# EAGLE design pic_web_dil (EAGLE 5.06)
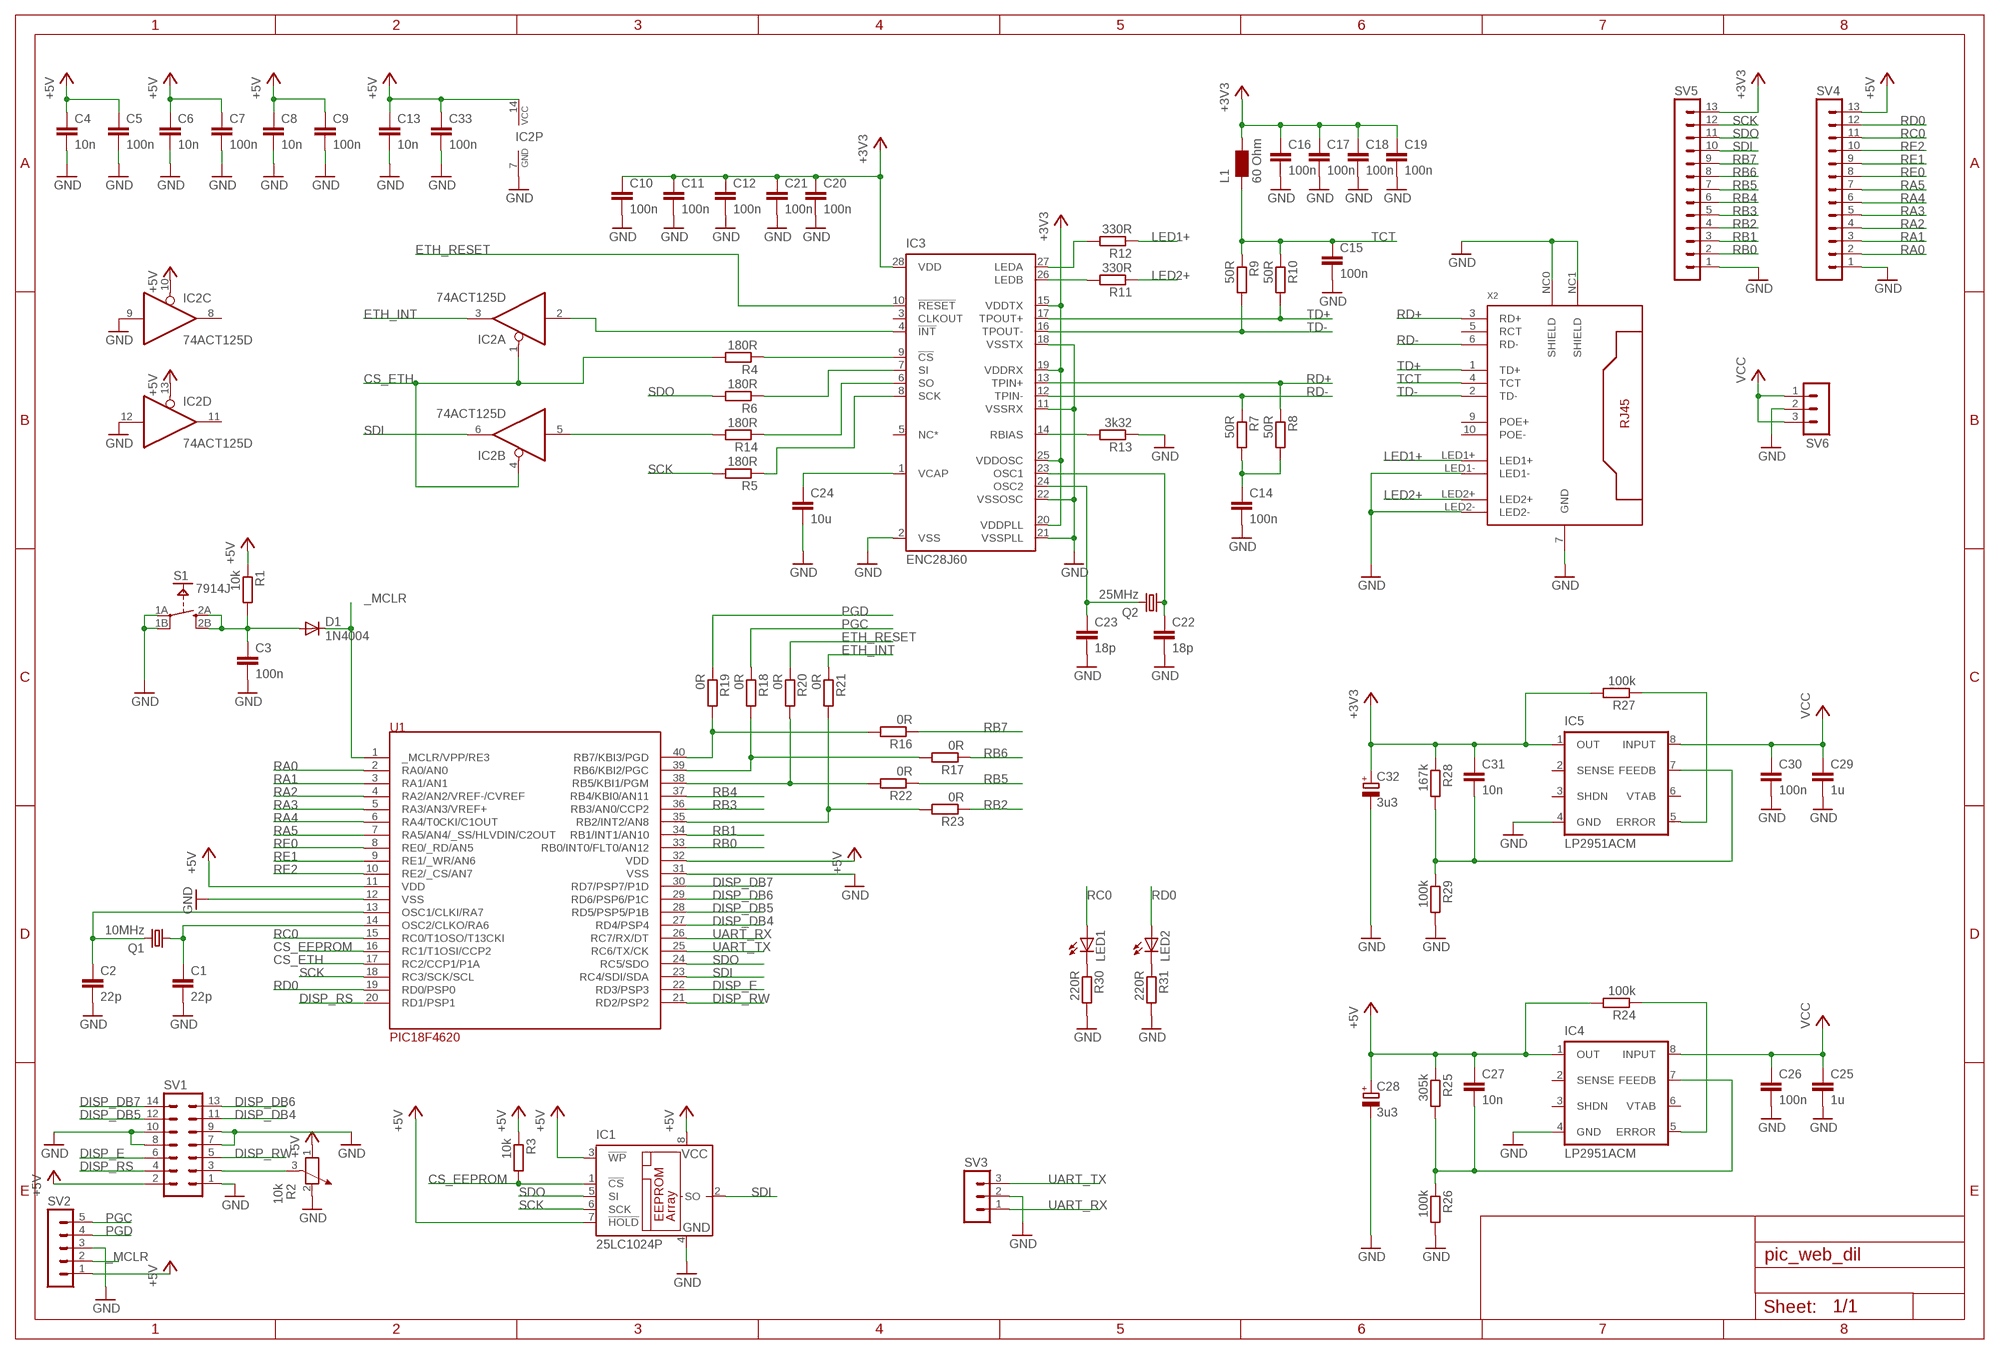
[diagram p0: schematic, sheet 1]

## Parts
C1  22p  C-EUC0603  [C0603]
C2  22p  C-EUC0603  [C0603]
C3  100n  C-EUC0603  [C0603]
C4  10n  C-EUC0603  [C0603]
C5  100n  C-EUC0603  [C0603]
C6  10n  C-EUC0603  [C0603]
C7  100n  C-EUC0603  [C0603]
C8  10n  C-EUC0603  [C0603]
C9  100n  C-EUC0603  [C0603]
C10  100n  C-EUC0603  [C0603]
C11  100n  C-EUC0603  [C0603]
C12  100n  C-EUC0603  [C0603]
C13  10n  C-EUC0603  [C0603]
C14  100n  C-EUC0603  [C0603]
C15  100n  C-EUC0603  [C0603]
C16  100n  C-EUC0603  [C0603]
C17  100n  C-EUC0603  [C0603]
C18  100n  C-EUC0603  [C0603]
C19  100n  C-EUC0603  [C0603]
C20  100n  C-EUC0603  [C0603]
C21  100n  C-EUC0603  [C0603]
C22  18p  C-EUC0603  [C0603]
C23  18p  C-EUC0603  [C0603]
C24  10u  C-EUC1210  [C1210]
C25  1u  C-EUC0603  [C0603]
C26  100n  C-EUC0603  [C0603]
C27  10n  C-EUC0603  [C0603]
C28  3u3  CPOL-EUB/3528-21W  [B/3528-21W]
C29  1u  C-EUC0603  [C0603]
C30  100n  C-EUC0603  [C0603]
C31  10n  C-EUC0603  [C0603]
C32  3u3  CPOL-EUB/3528-21W  [B/3528-21W]
C33  100n  C-EUC0603  [C0603]
D1  1N4004  DIODE-MELF-MLL41  [MELF-MLL41]
IC1  25LC1024P  [DIL8]
IC2  74ACT125D  [SO14]
IC3  ENC28J60  ENC28J60SP  [DIL28-3]
IC4  LP2951ACM  [SO-08]
IC5  LP2951ACM  [SO-08]
L1  60 Ohm  WE-KIHQ_0805  [WE-KI_0805_B]
LED1  LEDCHIP-LED0603  [CHIP-LED0603]
LED2  LEDCHIP-LED0603  [CHIP-LED0603]
Q1  10MHz  CRYSTALHC49UP  [HC49UP]
Q2  25MHz  CRYSTALHC49UP  [HC49UP]
R1  10k  R-EU_R0603  [R0603]
R2  10k  POTENTIOMETER_PT-10  [PT-10]
R3  10k  R-EU_R0603  [R0603]
R4  180R  R-EU_R0603  [R0603]
R5  180R  R-EU_R0603  [R0603]
R6  180R  R-EU_R0603  [R0603]
R7  50R  R-EU_R0603  [R0603]
R8  50R  R-EU_R0603  [R0603]
R9  50R  R-EU_R0603  [R0603]
R10  50R  R-EU_R0603  [R0603]
R11  330R  R-EU_R0603  [R0603]
R12  330R  R-EU_R0603  [R0603]
R13  3k32  R-EU_R0603  [R0603]
R14  180R  R-EU_R0603  [R0603]
R16  0R  R-EU_R0603  [R0603]
R17  0R  R-EU_R0603  [R0603]
R18  0R  R-EU_R0603  [R0603]
R19  0R  R-EU_R0603  [R0603]
R20  0R  R-EU_R0603  [R0603]
R21  0R  R-EU_R0603  [R0603]
R22  0R  R-EU_R0603  [R0603]
R23  0R  R-EU_R0603  [R0603]
R24  100k  R-EU_R0603  [R0603]
R25  305k  R-EU_R0603  [R0603]
R26  100k  R-EU_R0603  [R0603]
R27  100k  R-EU_R0603  [R0603]
R28  167k  R-EU_R0603  [R0603]
R29  100k  R-EU_R0603  [R0603]
R30  220R  R-EU_R0603  [R0603]
R31  220R  R-EU_R0603  [R0603]
S1  7914J  [7914SMD]
SV1  MA07-2  [MA07-2]
SV2  MA05-1  [MA05-1]
SV3  MA03-1  [MA03-1]
SV4  MA13-1  [MA13-1]
SV5  MA13-1  [MA13-1]
SV6  MA03-1  [MA03-1]
U1  PIC18F4620  PIC18F4620-I/P  [DIL40]
X2  RJ45-8-POETAIMAG  [WE_POE]

## Nets
+3V3: C10.1 C11.1 C12.1 C16.1 C17.1 C18.1 C19.1 C20.1 C21.1 C31.1 C32.+ IC3.15(VDDTX) IC3.19(VDDRX) IC3.20(VDDPLL) IC3.25(VDDOSC) IC3.28(VDD) IC5.1(OUT) L1.1 R27.2 R28.1 SV5.13
+5V: C4.1 C5.1 C6.1 C7.1 C8.1 C9.1 C13.1 C27.1 C28.+ C33.1 IC1.3(!WP) IC1.7(!HOLD) IC1.8(VCC) IC2.10(C:OE) IC2.13(D:OE) IC2.14(P:VCC) IC4.1(OUT) R1.1 R2.1 R3.1 R24.2 R25.1 SV1.2 SV2.1 SV4.13 U1.11(VDD) U1.32(VDD)
_MCLR: D1.C SV2.2 U1.1(_MCLR/VPP/RE3)
CS_EEPROM: IC1.1(!CS) R3.2 U1.16(RC1/T1OSI/CCP2)
CS_ETH: IC2.1(A:OE) IC2.4(B:OE) R4.2 U1.17(RC2/CCP1/P1A)
DISP_DB4: SV1.11 U1.27(RD4/PSP4)
DISP_DB5: SV1.12 U1.28(RD5/PSP5/P1B)
DISP_DB6: SV1.13 U1.29(RD6/PSP6/P1C)
DISP_DB7: SV1.14 U1.30(RD7/PSP7/P1D)
DISP_E: SV1.6 U1.22(RD3/PSP3)
DISP_RS: SV1.4 U1.20(RD1/PSP1)
DISP_RW: SV1.5 U1.21(RD2/PSP2)
ETH_INT: IC2.3(A:O) R21.1
ETH_RESET: IC3.10(!RESET) R20.1
GND: C1.2 C2.2 C3.2 C4.2 C5.2 C6.2 C7.2 C8.2 C9.2 C10.2 C11.2 C12.2 C13.2 C14.2 C15.2 C16.2 C17.2 C18.2 C19.2 C20.2 C21.2 C22.2 C23.2 C24.2 C25.2 C26.2 C28.- C29.2 C30.2 C32.- C33.2 IC1.4(GND) IC2.7(P:GND) IC2.9(C:I) IC2.12(D:I) IC3.2(VSS) IC3.11(VSSRX) IC3.18(VSSTX) IC3.21(VSSPLL) IC3.22(VSSOSC) IC4.4(GND) IC5.4(GND) R2.2 R13.1 R26.2 R29.2 R30.2 R31.2 S1.1A(P) S1.1B(P) SV1.1 SV1.7 SV1.8 SV1.9 SV1.10 SV2.3 SV3.2 SV4.1 SV5.1 SV6.2 U1.12(VSS) U1.31(VSS) X2.7(GND) X2.LED1- X2.LED2- X2.NC0(SHIELD) X2.NC1(SHIELD)
LED1+: R12.1 X2.LED1+
LED2+: R11.1 X2.LED2+
N$1: C2.1 Q1.2 U1.13(OSC1/CLKI/RA7)
N$2: C1.1 Q1.1 U1.14(OSC2/CLKO/RA6)
N$3: C3.1 D1.A R1.2 S1.2A(S) S1.2B(S)
N$4: R2.3 SV1.3
N$5: LED1.C R30.1
N$6: IC3.6(SO) R14.1
N$7: IC3.7(SI) R6.1
N$8: IC3.26(LEDB) R11.2
N$9: IC3.8(SCK) R5.1
N$10: IC3.9(!CS) R4.1
N$11: IC3.27(LEDA) R12.2
N$13: C14.1 R7.2 R8.2
N$14: C23.1 IC3.24(OSC2) Q2.2
N$15: C22.1 IC3.23(OSC1) Q2.1
N$16: IC3.14(RBIAS) R13.2
N$17: C24.1 IC3.1(VCAP)
N$18: R20.2 R22.2 U1.38(RB5/KBI1/PGM)
N$19: LED2.C R31.1
N$20: R17.2 R18.2 U1.39(RB6/KBI2/PGC)
N$21: R16.2 R19.2 U1.40(RB7/KBI3/PGD)
N$22: R21.2 R23.2 U1.35(RB2/INT2/AN8)
N$23: IC4.5(ERROR) R24.1
N$24: IC5.5(ERROR) R27.1
N$25: C31.2 IC5.7(FEEDB) R28.2 R29.1
N$26: C27.2 IC4.7(FEEDB) R25.2 R26.1
N$29: IC2.2(A:I) IC3.4(!INT)
N$30: IC2.5(B:I) R14.2
PGC: R18.1 SV2.5
PGD: R19.1 SV2.4
RA0: SV4.2 U1.2(RA0/AN0)
RA1: SV4.3 U1.3(RA1/AN1)
RA2: SV4.4 U1.4(RA2/AN2/VREF-/CVREF)
RA3: SV4.5 U1.5(RA3/AN3/VREF+)
RA4: SV4.6 U1.6(RA4/T0CKI/C1OUT)
RA5: SV4.7 U1.7(RA5/AN4/_SS/HLVDIN/C2OUT)
RB0: SV5.2 U1.33(RB0/INT0/FLT0/AN12)
RB1: SV5.3 U1.34(RB1/INT1/AN10)
RB2: R23.1 SV5.4
RB3: SV5.5 U1.36(RB3/AN0/CCP2)
RB4: SV5.6 U1.37(RB4/KBI0/AN11)
RB5: R22.1 SV5.7
RB6: R17.1 SV5.8
RB7: R16.1 SV5.9
RC0: LED1.A SV4.11 U1.15(RC0/T1OSO/T13CKI)
RD0: LED2.A SV4.12 U1.19(RD0/PSP0)
RD+: IC3.13(TPIN+) R8.1 X2.3(RD+)
RD-: IC3.12(TPIN-) R7.1 X2.6(RD-)
RE0: SV4.8 U1.8(RE0/_RD/AN5)
RE1: SV4.9 U1.9(RE1/_WR/AN6)
RE2: SV4.10 U1.10(RE2/_CS/AN7)
SCK: IC1.6(SCK) R5.2 SV5.12 U1.18(RC3/SCK/SCL)
SDI: IC1.2(SO) IC2.6(B:O) SV5.10 U1.23(RC4/SDI/SDA)
SDO: IC1.5(SI) R6.2 SV5.11 U1.24(RC5/SDO)
TCT: C15.1 L1.2 R9.1 R10.1 X2.4(TCT)
TD+: IC3.17(TPOUT+) R10.2 X2.1(TD+)
TD-: IC3.16(TPOUT-) R9.2 X2.2(TD-)
UART_RX: SV3.1 U1.26(RC7/RX/DT)
UART_TX: SV3.3 U1.25(RC6/TX/CK)
VCC: C25.1 C26.1 C29.1 C30.1 IC4.8(INPUT) IC5.8(INPUT) SV6.1 SV6.3
Unconnected: IC2.8(C:O) IC2.11(D:O) IC3.3(CLKOUT) IC3.5(NC*) IC4.2(SENSE) IC4.3(SHDN) IC4.6(VTAB) IC5.2(SENSE) IC5.3(SHDN) IC5.6(VTAB) X2.5(RCT)

## Power pins joined to a net without a drawn wire
POE+: X2.9(POE+)
POE-: X2.10(POE-)

## Library data of the parts
C1-C23 C25-C27 C29-C31 C33 = rcl:C-EU: CAPACITOR, European symbol
C24 = resistor:C-EU: CAPACITOR, European symbol
C28 C32 = rcl:CPOL-EU: POLARIZED CAPACITOR, European symbol
D1 = diode:DIODE-: DIODE
IC1 = sld:25*: Serial EEPROM 4 K, SPI bus
IC2 = 74xx-eu:74*125: Quad bus BUFFER, 3-state
IC3 = sld:ENC28J60: Stand-Alone Ethernet Controller with SPI Interface Source: http://ww1.microchip.com/downloads/en/DeviceDoc/39662c.pdf
IC4 IC5 = v-reg:LP2951?*: Series of Adjustable Micropower Voltage Regulators Source: http://cache.national.com/ds/LP/LP2950.pdf
L1 = wuerth-elektronik:WE-KIHQ: SMD Wire Wound Ceramic Inductor WE-KIHQ - High current - Highest Quality factor in size 0805 - up to 98 - High thermal stability - High SRF -- Bluetooth -- Wireless LAN -- RF oscillation circuit -- IF impedance matching -- IG choke
LED1 LED2 = led:LED: LED OSRAM: - CHIPLED LG R971, LG N971, LY N971, LG Q971, LY Q971, LO R971, LY R971 LH N974, LH R974 LS Q976, LO Q976, LY Q976 LO Q996 - Hyper CHIPLED LW Q18S LB Q993, LB Q99A, LB R99A - SideLED LS A670, LO A670, LY A670, LG A670, LP A670 LB A673, LV A673, LT A673, LW A673 LH A674 LY A675 LS A676, LA A676, LO A676, LY A676, LW A676 LS A679, LY A679, LG A679 - Hyper Micro SIDELED® LS Y876, LA Y876, LO Y876, LY Y876 LT Y87S - SmartLED LW L88C, LW L88S LB L89C, LB L89S, LG L890 LS L89K, LO L89K, LY L89K LS L896, LA L896, LO L896, LY L896 - TOPLED LS T670, LO T670, LY T670, LG T670, LP T670 LSG T670, LSP T670, LSY T670, LOP T670, LYG T670 LG T671, LOG T671, LSG T671 LB T673, LV T673, LT T673, LW T673 LH T674 LS T676, LA T676, LO T676, LY T676, LB T676, LH T676, LSB T676, LW T676 LB T67C, LV T67C, LT T67C, LS T67K, LO T67K, LY T67K, LW E67C LS E67B, LA E67B, LO E67B, LY E67B, LB E67C, LV E67C, LT E67C LW T67C LS T679, LY T679, LG T679 LS T770, LO T770, LY T770, LG T770, LP T770 LB T773, LV T773, LT T773, LW T773 LH T774 LS E675, LA E675, LY E675, LS T675 LS T776, LA T776, LO T776, LY T776, LB T776 LHGB T686 LT T68C, LB T68C - Hyper Mini TOPLED® LB M676 - Mini TOPLED Santana® LG M470 LS M47K, LO M47K, LY M47K Source: http://www.osram.convergy.de LUXEON: - LUMILED® LXK2-PW12-R00, LXK2-PW12-S00, LXK2-PW14-U00, LXK2-PW14-V00 LXK2-PM12-R00, LXK2-PM12-S00, LXK2-PM14-U00 LXK2-PE12-Q00, LXK2-PE12-R00, LXK2-PE12-S00, LXK2-PE14-T00, LXK2-PE14-U00 LXK2-PB12-K00, LXK2-PB12-L00, LXK2-PB12-M00, LXK2-PB14-N00, LXK2-PB14-P00, LXK2-PB14-Q00 LXK2-PR12-L00, LXK2-PR12-M00, LXK2-PR14-Q00, LXK2-PR14-R00 LXK2-PD12-Q00, LXK2-PD12-R00, LXK2-PD12-S00 LXK2-PH12-R00, LXK2-PH12-S00 LXK2-PL12-P00, LXK2-PL12-Q00, LXK2-PL12-R00 Source: www.luxeon.com KINGBRIGHT: KA-3528ASYC Source: www.kingbright.com
Q1 Q2 = sld:CRYSTAL: CRYSTAL
R1 R3-R14 R16-R31 = rcl:R-EU_: RESISTOR, European symbol
R2 = rcl:POTENTIOMETER_: Potentiometer
S1 = sld:7914J
SV1 = con-lstb:MA07-2: PIN HEADER
SV2 = con-lstb:MA05-1: PIN HEADER
SV3 SV6 = con-lstb:MA03-1: PIN HEADER
SV4 SV5 = con-lstb:MA13-1: PIN HEADER
U1 = sld:PIC18F4620
X2 = welectronic:RJ45-8-POE: Würth Elektronik RJ45: WE-7499211121 Taimag RJ45: RJPLB-203TC1 Tyco RJ45: 6605822

## Board
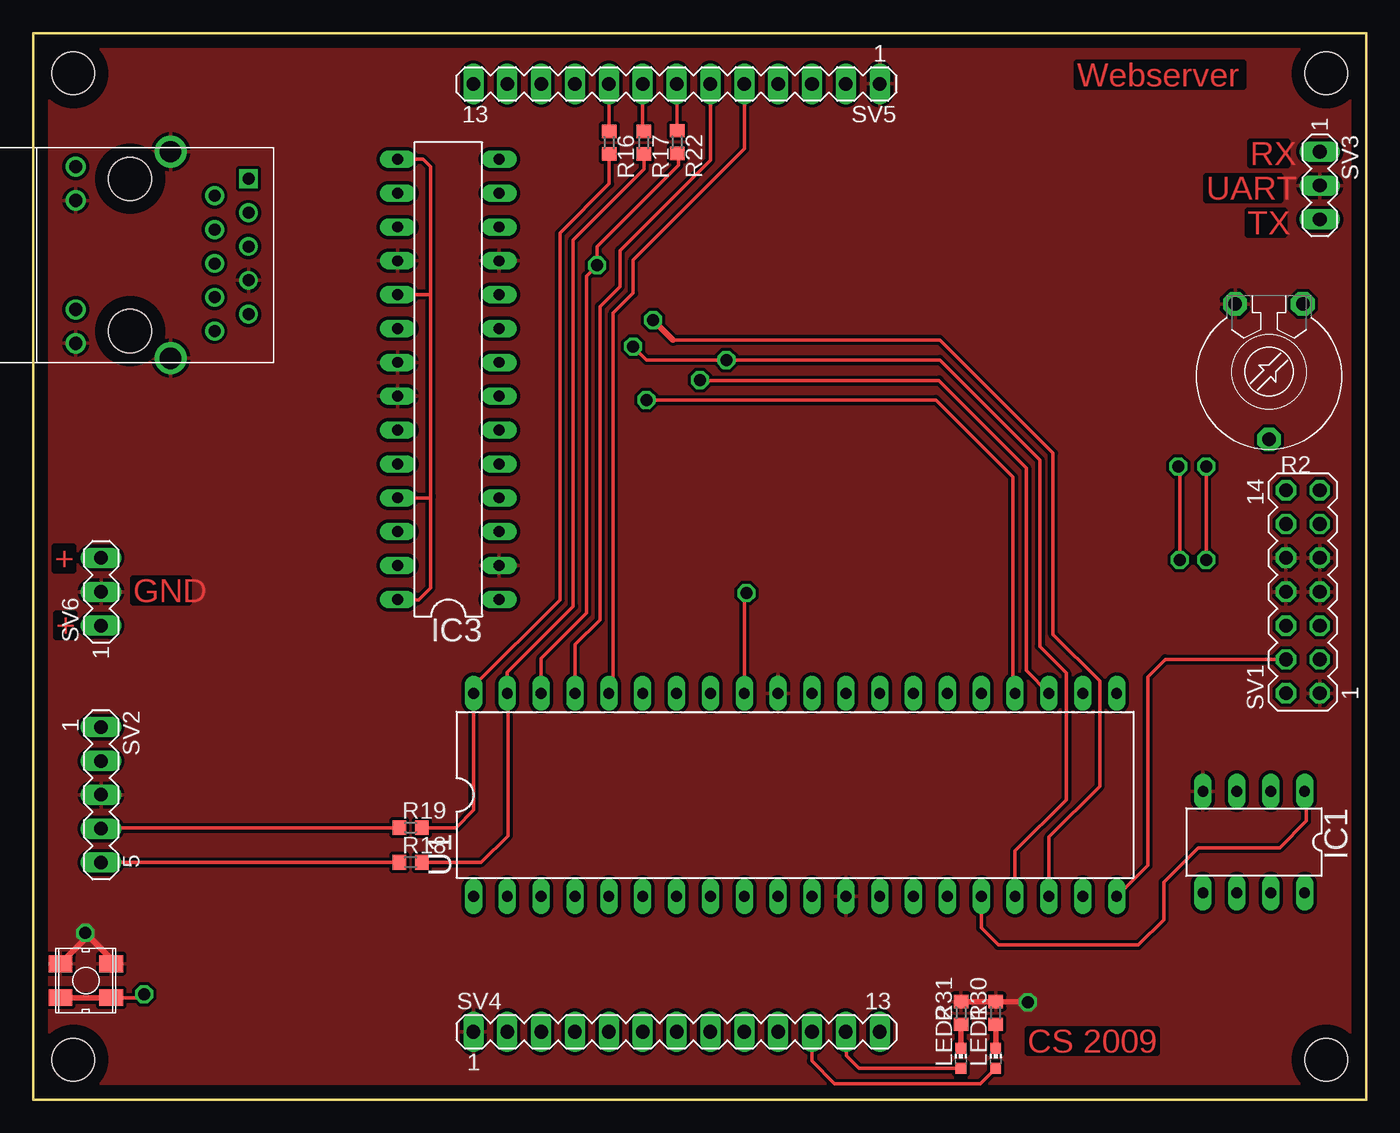
[diagram p1: board, top side]
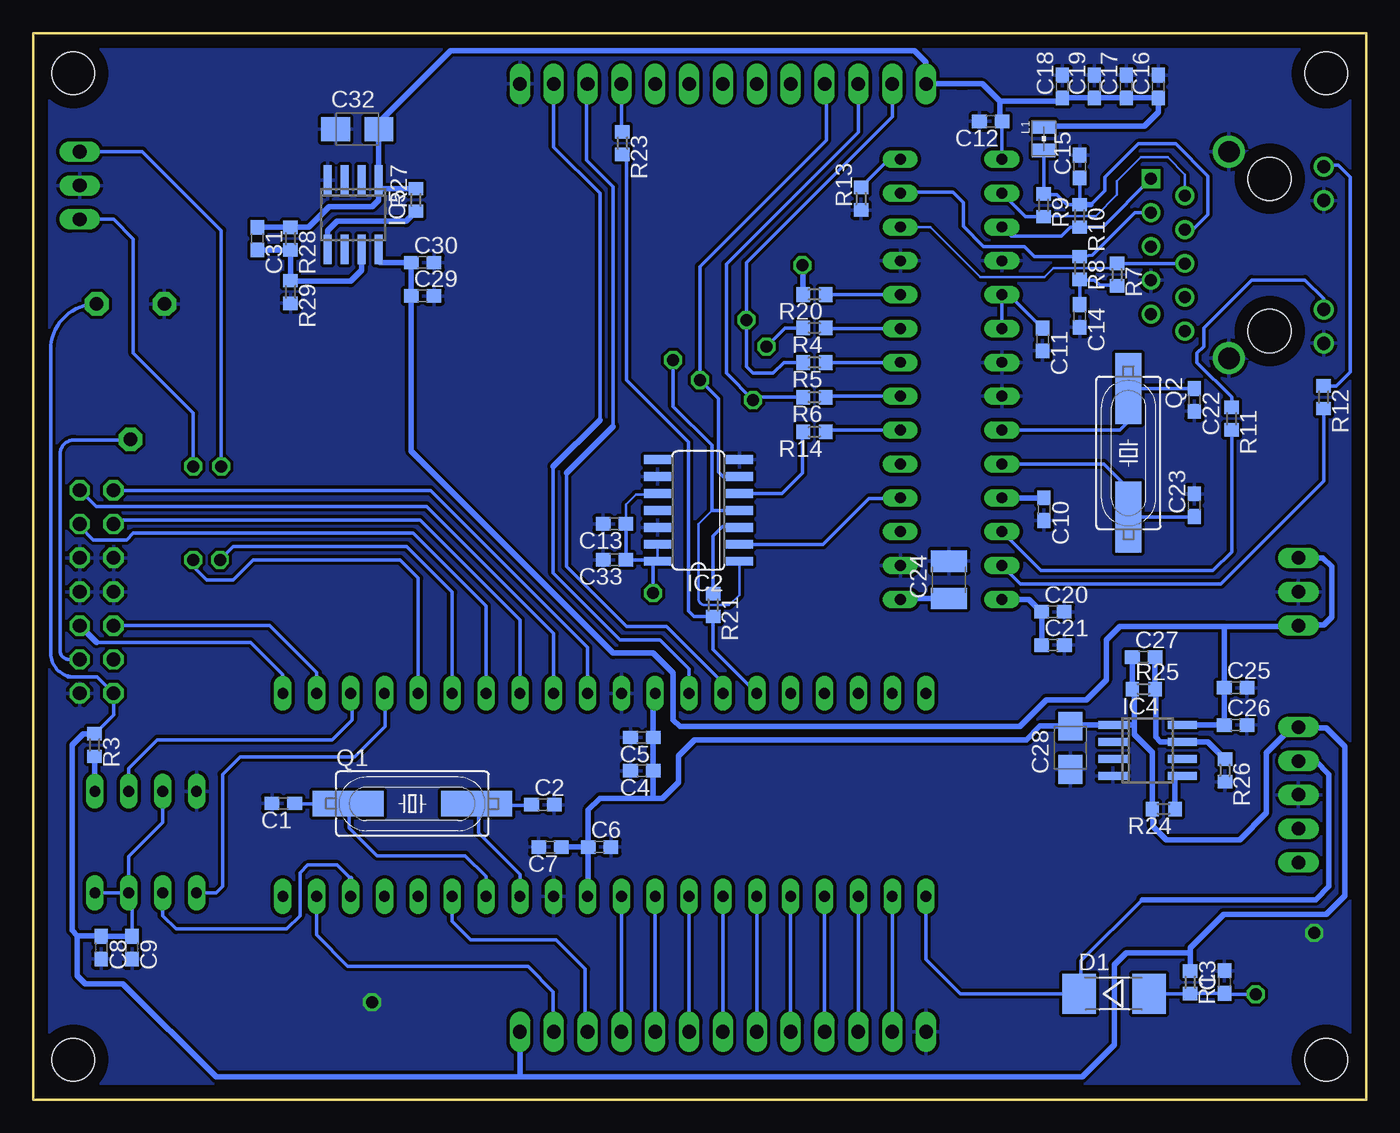
[diagram p2: board, bottom side, seen from below]

Size 100 x 80 mm. Coordinates in mm from the lower left corner, seen from the top.
Outline: 0,0 100,0 100,80 0,80 0,0
Copper layers (1*16): Top 0.035mm / dielectric 1.5mm / Bottom 0.035mm
Design rules "default *": minimum track width 0.2mm, minimum drill 0.4mm, track to track 0.25mm, track to pad 0.25mm, pad to pad 0.25mm, via to via 0.25mm, smd to smd 0.25mm, copper to edge 1mm, drill to drill 0.25mm, minimum pad ring 10mil, minimum via ring 8mil, stop-mask expansion 4mil, vias tented up to drill 0mil, thermal gap 10mil
Holes 3.2 mm at 3,77 97,77 97,3 3,3

### Footprints (pad centres in the part's own frame; a part is rotated, then mirrored left to right if it is on the bottom)
C0603 = smd 1.1 x 1: 1 -0.85,0; 2 0.85,0
C1210 = smd 1.6 x 2.7: 1 -1.4,0; 2 1.4,0
B/3528-21W = smd 2.15 x 1.8: + 1.625,0; - -1.625,0
MELF-MLL41 = smd 2.5 x 3: A 2.625,0; C -2.625,0
DIL8 = drill 0.813 long: 1 -3.81,-3.81; 2 -1.27,-3.81; 3 1.27,-3.81; 4 3.81,-3.81; 5 3.81,3.81; 6 1.27,3.81; 7 -1.27,3.81; 8 -3.81,3.81
SO14 = smd 0.66 x 2.032: 1 -3.81,-3.073; 2 -2.54,-3.073; 3 -1.27,-3.073; 4 0,-3.073; 5 1.27,-3.073; 6 2.54,-3.073; 7 3.81,-3.073; 8 3.81,3.073; 9 2.54,3.073; 10 1.27,3.073; 11 0,3.073; 12 -1.27,3.073; 13 -2.54,3.073; 14 -3.81,3.073
DIL28-3 = drill 0.813 long: 1 -16.51,-3.81; 2 -13.97,-3.81; 3 -11.43,-3.81; 4 -8.89,-3.81; 5 -6.35,-3.81; 6 -3.81,-3.81; 7 -1.27,-3.81; 8 1.27,-3.81; 9 3.81,-3.81; 10 6.35,-3.81; 11 8.89,-3.81; 12 11.43,-3.81; 13 13.97,-3.81; 14 16.51,-3.81; 15 16.51,3.81; 16 13.97,3.81; 17 11.43,3.81; 18 8.89,3.81; 19 6.35,3.81; 20 3.81,3.81; 21 1.27,3.81; 22 -1.27,3.81; 23 -3.81,3.81; 24 -6.35,3.81; 25 -8.89,3.81; 26 -11.43,3.81; 27 -13.97,3.81; 28 -16.51,3.81
SO-08 = smd 0.6 x 2.2: 1 -1.905,-2.6; 2 -0.635,-2.6; 3 0.635,-2.6; 4 1.905,-2.6; 5 1.905,2.6; 6 0.635,2.6; 7 -0.635,2.6; 8 -1.905,2.6
WE-KI_0805_B = smd 1.02 x 1.78: 1 -0.89,0; 2 0.89,0
CHIP-LED0603 = smd 0.8 x 0.8: A 0,-0.75; C 0,0.75
HC49UP = smd 5.334 x 1.93: 1 -4.826,0; 2 4.826,0
R0603 = smd 1 x 1.1: 1 -0.85,0; 2 0.85,0
PT-10 = drill 1.016 pad 1.778 octagon: 1 -2.54,-5.08; 2 2.54,-5.08; 3 0,5.08
7914SMD = smd 1.27 x 1.778: 1A 0,0; 1B 0,3.81; 2A 2.54,0; 2B 2.54,3.81
MA07-2 = drill 1.016 octagon: 1 -7.62,-1.27; 2 -7.62,1.27; 3 -5.08,-1.27; 4 -5.08,1.27; 5 -2.54,-1.27; 6 -2.54,1.27; 7 0,-1.27; 8 0,1.27; 9 2.54,-1.27; 10 2.54,1.27; 11 5.08,-1.27; 12 5.08,1.27; 13 7.62,-1.27; 14 7.62,1.27
MA05-1 = drill 1.016 long: 1 -5.08,0; 2 -2.54,0; 3 0,0; 4 2.54,0; 5 5.08,0
MA03-1 = drill 1.016 long: 1 -2.54,0; 2 0,0; 3 2.54,0
MA13-1 = drill 1.016 long: 1 -15.24,0; 2 -12.7,0; 3 -10.16,0; 4 -7.62,0; 5 -5.08,0; 6 -2.54,0; 7 0,0; 8 2.54,0; 9 5.08,0; 10 7.62,0; 11 10.16,0; 12 12.7,0; 13 15.24,0
DIL40 = drill 0.813 long: 1 -24.13,-7.62; 2 -21.59,-7.62; 3 -19.05,-7.62; 4 -16.51,-7.62; 5 -13.97,-7.62; 6 -11.43,-7.62; 7 -8.89,-7.62; 8 -6.35,-7.62; 9 -3.81,-7.62; 10 -1.27,-7.62; 11 1.27,-7.62; 12 3.81,-7.62; 13 6.35,-7.62; 14 8.89,-7.62; 15 11.43,-7.62; 16 13.97,-7.62; 17 16.51,-7.62; 18 19.05,-7.62; 19 21.59,-7.62; 20 24.13,-7.62; 21 24.13,7.62; 22 21.59,7.62; 23 19.05,7.62; 24 16.51,7.62; 25 13.97,7.62; 26 11.43,7.62; 27 8.89,7.62; 28 6.35,7.62; 29 3.81,7.62; 30 1.27,7.62; 31 -1.27,7.62; 32 -3.81,7.62; 33 -6.35,7.62; 34 -8.89,7.62; 35 -11.43,7.62; 36 -13.97,7.62; 37 -16.51,7.62; 38 -19.05,7.62; 39 -21.59,7.62; 40 -24.13,7.62
WE_POE = drill 0.9 square: 1 -5.715,8.89 | drill 0.9 round: 2 -4.445,6.35; 3 -3.175,8.89; 4 -1.905,6.35; 5 -0.635,8.89; 6 0.635,6.35; 7 1.905,8.89; 8 3.175,6.35; 9 4.445,8.89; 10 5.715,6.35 | drill 1 round: LED1+ -6.629,-4.064; LED1- -4.089,-4.064; LED2+ 4.089,-4.064; LED2- 6.629,-4.064 | drill 1.6 round: NC0 -7.747,3.048; NC1 7.747,3.048 | hole 3.25: -5.715,0; 5.715,0

### Placement (x,y rotation side)
C1  81.25,22.22 180 bottom
C2  61.77,22.12 0 bottom
C3  10.63,8.82 90 bottom
C4  54.34,24.67 180 bottom
C5  54.35,27.17 180 bottom
C6  57.52,18.95 0 bottom
C7  61.23,18.95 180 bottom
C8  94.9,11.4 270 bottom
C9  92.6,11.4 270 bottom
C10  24.18,44.29 270 bottom
C11  24.28,57.03 270 bottom
C12  28.17,73.39 180 bottom
C13  56.4,43.2 180 bottom
C14  21.5,58.8 270 bottom
C15  21.5,70 90 bottom
C16  15.6,76 90 bottom
C17  18,76 90 bottom
C18  22.8,76 90 bottom
C19  20.4,76 90 bottom
C20  23.51,36.59 0 bottom
C21  23.5,34.1 0 bottom
C22  12.9,52.5 270 bottom
C23  12.9,44.6 90 bottom
C24  31.3,39 90 bottom
C25  9.8,30.9 0 bottom
C26  9.8,28.1 0 bottom
C27  16.7,33.2 0 bottom
C28  22.2,26.4 90 bottom
C29  70.8,60.3 0 bottom
C30  70.8,62.8 0 bottom
C31  83.2,64.6 270 bottom
C32  75.7,72.8 0 bottom
C33  56.4,40.5 180 bottom
D1  18.92,7.95 0 bottom
IC1  91.57,19.32 180 top
IC2  50.1,44.2 90 bottom
IC3  31.14,54.04 90 top
IC4  16.4,26.2 270 bottom
IC5  76,66.4 180 bottom
L1  24.2,72.1 270 bottom
LED1  72.2,3.1 0 top
LED2  69.6,3.1 0 top
Q1  71.56,22.2 0 bottom
Q2  17.84,48.52 270 bottom
R1  13.21,8.8 270 bottom
R2  92.71,54.61 180 top
R3  95.4,26.6 270 bottom
R4  41.4,57.9 180 bottom
R5  41.4,55.3 180 bottom
R6  41.4,52.7 180 bottom
R7  18.7,61.9 270 bottom
R8  21.5,62.4 270 bottom
R9  24.2,67.1 270 bottom
R10  21.5,66.3 270 bottom
R11  10.1,51.1 270 bottom
R12  3.2,52.7 270 bottom
R13  37.9,67.6 90 bottom
R14  41.4,50.1 180 bottom
R16  43.2,71.8 270 top
R17  45.8,71.8 270 top
R18  28.3,17.8 0 top
R19  28.3,20.4 0 top
R20  41.4,60.4 180 bottom
R21  49,37.1 270 bottom
R22  48.31,71.84 270 top
R23  55.81,71.76 270 bottom
R24  15.2,21.8 180 bottom
R25  16.7,30.8 0 bottom
R26  10.6,24.7 270 bottom
R27  71.3,67.5 90 bottom
R28  80.7,64.6 270 bottom
R29  80.7,60.6 270 bottom
R30  72.2,6.5 90 top
R31  69.6,6.5 90 top
S1  2.03,10.19 270 top
SV1  95.25,38.1 90 top
SV2  5.08,22.86 270 top
SV3  96.52,68.58 270 top
SV4  48.26,5.08 0 top
SV5  48.26,76.2 180 top
SV6  5.08,38.1 90 top
U1  57.15,22.86 0 top
X2  7.25,63.37 270 top

### Tracks (layer width: path | path; a pad name or v marks a point on that pad's centre or on a via)
+3V3
  Top 0.25: IC3.15 29.25,70.55 29.8,70 29.8,60.1 | 29.8,45.4 29.8,38.4 28.9,37.5 27.36,37.5 IC3.28 | 29.8,45.4 29.8,60.1 | IC3.25 29.8,45.15 29.8,45.4 | IC3.19 29.8,60.39 29.8,60.1
  Bottom 0.25: IC3.15 C12.1 | IC3.20 IC3.19 26.79,60.39 C11.1
  Bottom 0.4: C18.1 23.06,74.89 27.49,74.89 | 24.14,73.05 16.65,73.05 15.6,74.1 C16.1
  Bottom 0.406: 24.14,73.05 L1.1 | C18.1 C19.1 C17.1 C16.1 | 30.6,76.2 30,76.2 | 30.6,76.2 SV5.13 33.02,77.82 33.9,78.7 68.7,78.7 69.8,77.6 | C12.1 27.49,73.39 27.49,74.89 28.8,76.2 30.6,76.2 | IC3.15 | 69.8,77.6 70.6,76.8 | C21.1 C20.1 25.3,37.53 IC3.28 | C10.1 IC3.25 | C31.1 R28.1 79.35,65.45 77.8,67 74.6,67 74.1,67.5 74.1,68.4 | 74.1,68.4 IC5.1 74.09,72.78 C32.+ 74.08,73.33 69.8,77.6 | R27.2 74.05,68.35 74.1,68.4 | 69.8,77.6 68.8,78.6
+5V  (via drill 0.9)
  Top 0.25: U1.32 53.34,37.84 v53.5,38
  Bottom 0.2: 53.28,40.5 53.17,40.5 IC2.13 | C13.1 55.55,44.65 54.8,45.4 53.24,45.4 IC2.10
  Bottom 0.25: 96.9,31.7 95.2,31.7 SV1.2 93.98,28.87 R3.1 | 96.9,31.7 97.4,31.7 | 95.4,15.49 IC1.8 IC1.7 92.84,18.26 90.3,20.8 IC1.3 | 92.6,12.4 92.6,15.27 | 53.28,40.5 C33.1 C13.1 | IC2.14 53.5,40.39 v53.5,38 | R2.1 arc-90 98.7,56.24 98.7,33.5 arc-90 96.9,31.7
  Bottom 0.406: C6.1 C7.1 | C8.1 C9.1 | C8.1 92.75,12.25 92.6,12.4 | 92.6,15.27 IC1.7 | 17.4,28.2 17.4,27.4 16.05,26.05 R24.2 16,21.75 16,20.5 15,19.5 9.5,19.5 7.5,21.5 7.5,26 5.56,27.94 SV2.1 5.04,27.9 3,27.9 1.6,26.5 1.6,15.3 3,13.9 10.7,13.9 13.21,11.39 13.21,11 | 17.4,28.2 17.4,30.65 R25.1 C27.1 | 17.4,28.2 17.5,28.1 IC4.1 22.12,28.11 C28.+ 24.48,28.02 25.5,27 50.4,27 51.6,25.8 51.6,23.8 52.8,22.6 53.4,22.6 | C6.1 58.37,21.73 57.5,22.6 53.4,22.6 | C6.1 58.37,15.29 U1.11 | 13.21,11 R1.1 | 63.4,1.7 86.3,1.7 93.3,8.7 96.1,8.7 96.7,9.3 96.7,12.3 | SV4.13 63.5,1.8 63.4,1.7 | 63.4,1.7 21.3,1.7 18.9,4.1 18.9,10.1 18,11 13.21,11 | 53.4,22.6 53.49,22.69 C4.1 C5.1 53.5,30.32 U1.32 | 96.7,12.3 94.95,12.3 C8.1 | R3.1 96.25,27.45 97.1,26.6 97.1,12.7 96.7,12.3 | IC2.14 53.28,40.5
_MCLR
  Bottom 0.25: D1.C 30.45,7.95 33.02,10.52 U1.1 | 16.8,15 21.4,10.4 21.4,8.1
  Bottom 0.406: 16.8,15 3.8,15 2.8,16 2.8,24.4 3.8,25.4 SV2.2 | 21.4,8.1 D1.C
CS_EEPROM
  Top 0.25: U1.16 71.12,12.88 72.4,11.6 82.9,11.6 84.8,13.5 84.8,16.3 87.4,18.9 93.5,18.9 95.5,20.9 95.5,23.01
  Top 0.406: 95.5,23.01 IC1.1
  Bottom 0.406: R3.2 95.4,23.15 IC1.1
CS_ETH  (via drill 0.9)
  Top 0.25: U1.17 73.66,18.66 77.5,22.5 77.5,32 75.5,34 75.5,48 68,55.5 v52,55.5 46,55.5 v45,56.5
  Bottom 0.2: IC2.1 47.03,37.87 47.8,37.1 49.6,37.1 arc90 50.1,37.6 50.1,43.2 49.1,44.2
  Bottom 0.25: v45,56.5 43.6,57.9 R4.2 | v52,55.5 52,52 49.1,49.1 49.1,44.2 IC2.4
DISP_DB4
  Bottom 0.25: U1.27 66.04,37.04 71.5,42.5 92.5,42.5 93,42 95.5,42 96.52,43.02
  Bottom 0.406: 96.52,43.02 SV1.11
DISP_DB5
  Bottom 0.25: U1.28 63.5,36 71,43.5 93.5,43.5 93.82,43.18 SV1.12
DISP_DB6
  Bottom 0.25: U1.29 60.96,34.96 70.5,44.5 95.3,44.5 SV1.13
DISP_DB7
  Bottom 0.25: SV1.14 93.96,45.7 70.2,45.7 58.42,33.92 U1.30
DISP_E
  Bottom 0.25: U1.22 78.74,32.04 81.8,35.1 82.26,35.56 SV1.6
DISP_RS
  Top 0.25: SV1.4 84.92,33.02 83.6,31.7 83.6,17.56 U1.20
DISP_RW
  Bottom 0.25: 95.26,34.3 83.7,34.3 81.3,31.9 81.3,30.5 U1.21
  Bottom 0.406: 95.26,34.3 SV1.5
ETH_INT
  Bottom 0.25: R21.1 49,42.3 48.3,43 47.1,43
  Bottom 0.406: 47.1,43 IC2.3
ETH_RESET
  Bottom 0.25: IC3.10 R20.1
  Bottom 0.406: R20.1
GND  (via drill 0.9)
  Top 0.406: S1.1B 5.84,10.56 v3.9,12.5 3.9,12.06 S1.1A | R31.2 R30.2 74.55,7.35 v74.6,7.3
  pour Bottom: 0,80 0,0 100,0 100,80
  pour Top: 0,80 0,0 100,0 100,80
LED1+
  Bottom 0.25: X2.LED1+ 3.08,70.1 2.1,70.1 1.9,69.9 1.2,69.2 1.2,54.6 2.25,53.55 R12.1
LED2+
  Bottom 0.25: X2.LED2+ 3.19,60.09 4.6,61.5 8.6,61.5 12.2,57.9 12.2,56.5 12.7,56 12.7,55.3 10.1,52.7 R11.1
N$1
  Bottom 0.25: U1.13 63.5,16.9 66.6,20 66.6,22.07 62.67,22.07
  Bottom 0.406: 66.6,22.07 Q1.2 | 62.67,22.07 C2.1
N$2
  Bottom 0.25: U1.14 66.04,16.74 67.6,18.3 74.2,18.3 76.3,20.4 76.3,22.11 | Q1.1 80.38,22.2
  Bottom 0.406: 76.3,22.11 Q1.1 | 80.38,22.2 C1.1
N$3  (via drill 0.9)
  Top 0.25: S1.2B 8.05,7.65
  Top 0.406: S1.2A S1.2B | 8.05,7.65 v8.3,7.9
  Bottom 0.25: v8.3,7.9 10.56,7.9 | C3.1 13.19,7.97 | R1.2 D1.A
  Bottom 0.406: 10.56,7.9 C3.1 | 13.19,7.97 R1.2
N$4
  Bottom 0.25: SV1.3 97.32,33.02 arc90 98,33.7 98,48.4 arc90 96.9,49.5 92.74,49.5 arc-90 R2.3
N$5
  Top 0.406: LED1.C R30.1
N$6
  Bottom 0.25: IC3.6 40.42,50.23
  Bottom 0.406: 40.42,50.23 R14.1
N$7
  Bottom 0.25: IC3.7 40.48,52.77
  Bottom 0.406: 40.48,52.77 R6.1
N$8
  Bottom 0.25: IC3.26 24.42,39.7 11.5,39.7 10.1,41.1 10.1,41.3 R11.2
N$9
  Bottom 0.25: IC3.8 R5.1
  Bottom 0.406: IC3.8
N$10
  Bottom 0.25: IC3.9 40.5,57.85
  Bottom 0.406: 40.5,57.85 R4.1
N$11
  Bottom 0.25: R12.2 3.2,46.4 10.9,38.7 25.96,38.7 IC3.27
N$13
  Bottom 0.25: 18.75,61.1 20,61.1 20.4,61.5 21.45,61.5 R8.2 C14.1
  Bottom 0.406: 18.75,61.1 R7.2
N$14
  Bottom 0.25: IC3.24 19.69,47.69 17.8,45.8 | 12.96,43.69 Q2.2
  Bottom 0.406: 17.8,45.8 17.8,43.73 Q2.2 | C23.1 12.96,43.69
N$15
  Bottom 0.25: IC3.23 18.47,50.23 17.8,50.9 17.8,53.31 | C22.1 Q2.1
  Bottom 0.406: Q2.1 17.8,53.31 | C22.1
N$16
  Bottom 0.25: 35.8,70.55 R13.2
  Bottom 0.406: IC3.14 35.8,70.55
N$17
  Bottom 0.406: C24.1 34.88,37.6 IC3.1
N$18  (via drill 0.9)
  Top 0.25: U1.38 38.1,33.1 41.5,36.5 41.5,61.8 v42.3,62.6 42.3,64 48.4,70.1 48.4,70.9
  Top 0.406: 48.4,70.9 R22.2
  Bottom 0.406: R20.2 42.25,62.55 v42.3,62.6
N$19
  Top 0.406: LED2.C R31.1
N$20
  Top 0.25: R18.2 33.6,17.8 35.6,19.8 35.6,30.44 | U1.39 35.56,32.06 40.5,37 40.5,64.5 45.8,69.8 R17.2
  Top 0.406: 35.6,30.44 U1.39
N$21
  Top 0.25: R19.2 31.7,20.4 33.02,21.72 U1.40 33.02,31.02 39.5,37.5 39.5,65 43.2,68.7 R16.2
N$22
  Bottom 0.25: 55.5,70.91 55.5,54 50.85,49.35 50.85,36.65 50.45,36.25 R21.2 49,33.76 U1.35
  Bottom 0.406: 55.5,70.91 R23.2
N$23
  Bottom 0.406: R24.1 14.35,24.25 14.4,24.3 IC4.5
N$24
  Bottom 0.406: IC5.5 77.91,65.19 77.2,65.9 72.05,65.9 R27.1
N$25
  Bottom 0.406: IC5.7 75.36,62.23 76.2,61.4 80.65,61.4 R29.1 R28.2 C31.2
N$26
  Bottom 0.406: C27.2 R25.2 15.8,30.75 15.8,27.2 15.44,26.84 IC4.7 11.88,26.84 R26.1
N$29
  Bottom 0.25: IC2.2 40.74,41.66 37.3,45.1 35,45.1 IC3.4
N$30
  Bottom 0.25: IC2.5 43.83,45.47 42.3,47 42.3,50.05
  Bottom 0.406: 42.3,50.05 R14.2
PGC
  Top 0.25: SV2.5 27.43,17.78
  Top 0.406: 27.43,17.78 R18.1
PGD
  Top 0.25: 5.16,20.4 R19.1
  Top 0.406: SV2.4 5.16,20.4
RA0
  Bottom 0.25: SV4.2 U1.2
RA1
  Bottom 0.25: SV4.3 U1.3
RA2
  Bottom 0.25: SV4.4 U1.4
RA3
  Bottom 0.25: SV4.5 U1.5
RA4
  Bottom 0.25: SV4.6 U1.6
RA5
  Bottom 0.25: SV4.7 U1.7
RB0
  Bottom 0.25: SV5.2 60.96,71.46 57.5,68 57.5,51 | U1.33 50.8,32.3 53,34.5 56,34.5 61,39.5 61,47.5
  Bottom 0.406: 61,47.5 57.5,51
RB1
  Bottom 0.25: 56.5,50.5 56.5,68.5 58.5,70.5 58.5,76.12 SV5.3 | 48.26,31.26 52.5,35.5 55.5,35.5 60,40 60,47
  Bottom 0.406: U1.34 48.26,31.26 | 60,47 56.5,50.5
RB2
  Bottom 0.25: 55.88,72.68 SV5.4
  Bottom 0.406: R23.1 55.88,72.68
RB3
  Top 0.25: 43.5,30.8 43.5,59 45,60.5 45,63 53.34,71.34 53.34,73.5 SV5.5
  Top 0.406: U1.36 43.5,30.8
RB4
  Top 0.25: U1.37 40.64,34.14 42.5,36 42.5,59.5 44,61 44,63.7 50.8,70.5 SV5.6
RB5
  Top 0.25: R22.1 48.31,76.15 SV5.7
RB6
  Top 0.25: 45.72,72.73 SV5.8
  Top 0.406: R17.1 45.72,72.73
RB7
  Top 0.25: 43.18,72.67 SV5.9
  Top 0.406: R16.1 43.18,72.67
RC0
  Top 0.25: LED1.A 71.05,1.2 60.1,1.2 58.4,2.9 58.4,5.06 SV4.11
  Bottom 0.25: U1.15 68.58,13.38 67.2,12 60.8,12 58.6,9.8 58.6,5.26 SV4.11
RD0
  Top 0.25: LED2.A 61.95,2.35 61,3.3 61,5.04 SV4.12
  Bottom 0.25: U1.19 78.74,12.34 76.4,10 62.9,10 61,8.1 61,5.12 SV4.12
RD+
  Bottom 0.25: 34.89,68.07 30.99,68.07 30.23,67.31 30.23,65.53 28.7,64.01 25.65,64.01 24.9,63.25 R8.1 20.55,63.35 17.36,66.55 X2.3
  Bottom 0.406: 34.89,68.07 IC3.13
RD-
  Bottom 0.2: IC3.12 32.7,65.47 28.96,61.72 24.13,61.72 23.45,62.4 19.15,62.4
  Bottom 0.25: X2.6 18.68,62.73 | R7.1 18.75,62.8 19.15,62.4
  Bottom 0.406: 18.68,62.73 R7.1 18.71,62.74
RE0
  Bottom 0.25: SV4.8 U1.8
RE1
  Bottom 0.25: SV4.9 U1.9
RE2
  Bottom 0.25: SV4.10 U1.10
SCK  (via drill 0.9)
  Top 0.25: U1.18 76.2,19.7 80,23.5 80,31.4 76.5,34.9 76.5,48.5 68,57 48,57
  Top 0.406: 48,57 v46.5,58.5
  Bottom 0.25: 76.2,16.6 77.2,17.6 79.4,17.6 80,17 80,13.8 81,12.8 89.3,12.8 90.3,13.8 IC1.6 | SV5.12 35.56,73.74 46.5,62.8 v46.5,58.5 46.5,55 46,54.5 44.5,54.5 43.7,55.3 R5.2
  Bottom 0.406: U1.18 76.2,16.6
SDI  (via drill 0.9)
  Top 0.25: U1.23 74.5,32.18 74.5,47.4 67.95,53.95 50.05,53.95
  Top 0.406: v50,54 50.05,53.95
  Bottom 0.25: IC1.2 92.84,24.86 90.7,27 77.6,27 76.1,28.5 76.1,30.38 U1.23 | SV5.10 40.5,76.06 40.5,72 50,62.5 v50,54 49.2,53.2 48.6,52.6 48.6,47.1 48.24,46.74 IC2.6
SDO  (via drill 0.9)
  Top 0.25: U1.24 73.66,31.34 73.5,31.5 73.5,46.7 67.7,52.5 v46,52.5
  Bottom 0.25: IC1.5 86.29,15.51 85.8,16 85.8,24.4 84.5,25.7 75.9,25.7 73.6,28 73.6,30.42 U1.24 | SV5.11 38.1,72.6 48,62.7 48,54.5 v46,52.5 45.8,52.7 R6.2
TCT
  Bottom 0.25: R9.1 L1.2 | C15.1 R10.1 22.45,67.15 23.2,67.9 24.15,67.9 | 20.65,67.15 19.6,68.2 19.6,69.2 17.1,71.7 14.3,71.7 11.9,69.3 11.9,66.4 13.03,65.28 X2.4
  Bottom 0.406: 20.65,67.15 R10.1 | 24.15,67.9 R9.1
TD+
  Bottom 0.25: IC3.17 26.63,64.77 22.86,64.77 22.18,65.45 R10.2 19.77,65.45 X2.1
TD-
  Bottom 0.2: X2.2 13.6,69.4 14.9,70.7 16.9,70.7 18.7,68.9 18.7,67.9 20.3,66.3 24.15,66.3 arc-90 R9.2
  Bottom 0.25: R9.2 25.57,66.25 IC3.16
UART_RX  (via drill 0.9)
  Top 0.25: v86,40.5 86,47.4 v85.9,47.5
  Bottom 0.25: U1.26 68.58,38.08 72,41.5 85,41.5 v86,40.5 | SV3.1 91.82,71.12 85.9,65.2 v85.9,47.5
UART_TX  (via drill 0.9)
  Top 0.25: v88,40.5 v88,47.5
  Bottom 0.25: U1.25 71.12,39.12 72.5,40.5 83.5,40.5 85,39 87,39 88,40 v88,40.5 | v88,47.5 88,51.5 92.5,56 92.5,64.56 93.98,66.04 SV3.3
VCC
  Bottom 0.406: 5.6,35.56 SV6.1 | 10.7,30.95 C25.1 10.65,30.4 | 10.65,30.4 C26.1 IC4.8 | SV6.3 3.24,40.64 2.6,40 2.6,36.2 3.2,35.6 5.56,35.6 5.6,35.56 | 5.6,35.56 5.66,35.5 10.7,35.5 | 67.75,44.75 56.5,33.5 53.5,33.5 52,32 52,28.5 51.5,28 26,28 24,30 21,30 19.5,31.5 19.5,34.5 18.5,35.5 10.7,35.5 | 67.75,44.75 69,46 | 67.75,44.75 71.65,48.65 C29.1 C30.1 74,62.8 74.1,62.9 IC5.8 | 10.7,35.5 10.65,35.5 10.65,30.4

### Text on the board
Top: Webserver | RX | UART | TX | + | GND | + | CS 2009